# Altium schematic sheet BMS029B_FETs.SchDoc: FETs
size 431 x 279 mm; Date: Not shown in title block; ApprovedBy: Not shown in title block; CheckedBy: Not shown in title block; Author: Not shown in title block; CompanyName: Not shown in title block; DrawnBy: M Sunna; Engineer: Not shown in title block; Organization: Not shown in title block; Address1: Not shown in title block; Address2: Not shown in title block; Address3: Not shown in title block; Address4: Not shown in title block; DocumentNumber: 3; Revision: Use project parameter SCH_Rev; SheetNumber: 3; SheetTotal: 5; PageSetup: Record=PageOptions|CenterHorizontal=True|CenterVertical=True|PrintScale=1.00|XCorrection=1.00|YCorrection=1.00|PrintKind=0|BorderSize=5000000|LeftOffset=0|BottomOffset=0|Orientation=2|PaperLength=1000|PaperWidth=1000|Scale=100|PaperSource=15|PrintQuality=600|MediaType=1|DitherType=10|PaperKind=Letter|PrintScaleMode=1; CurrentTime: Not shown in title block; CurrentDate: Not shown in title block; Time: Not shown in title block; DocumentFullPathAndName: Not shown in title block; DocumentName: Not shown in title block; ModifiedDate: Not shown in title block; ImagePath: Not shown in title block
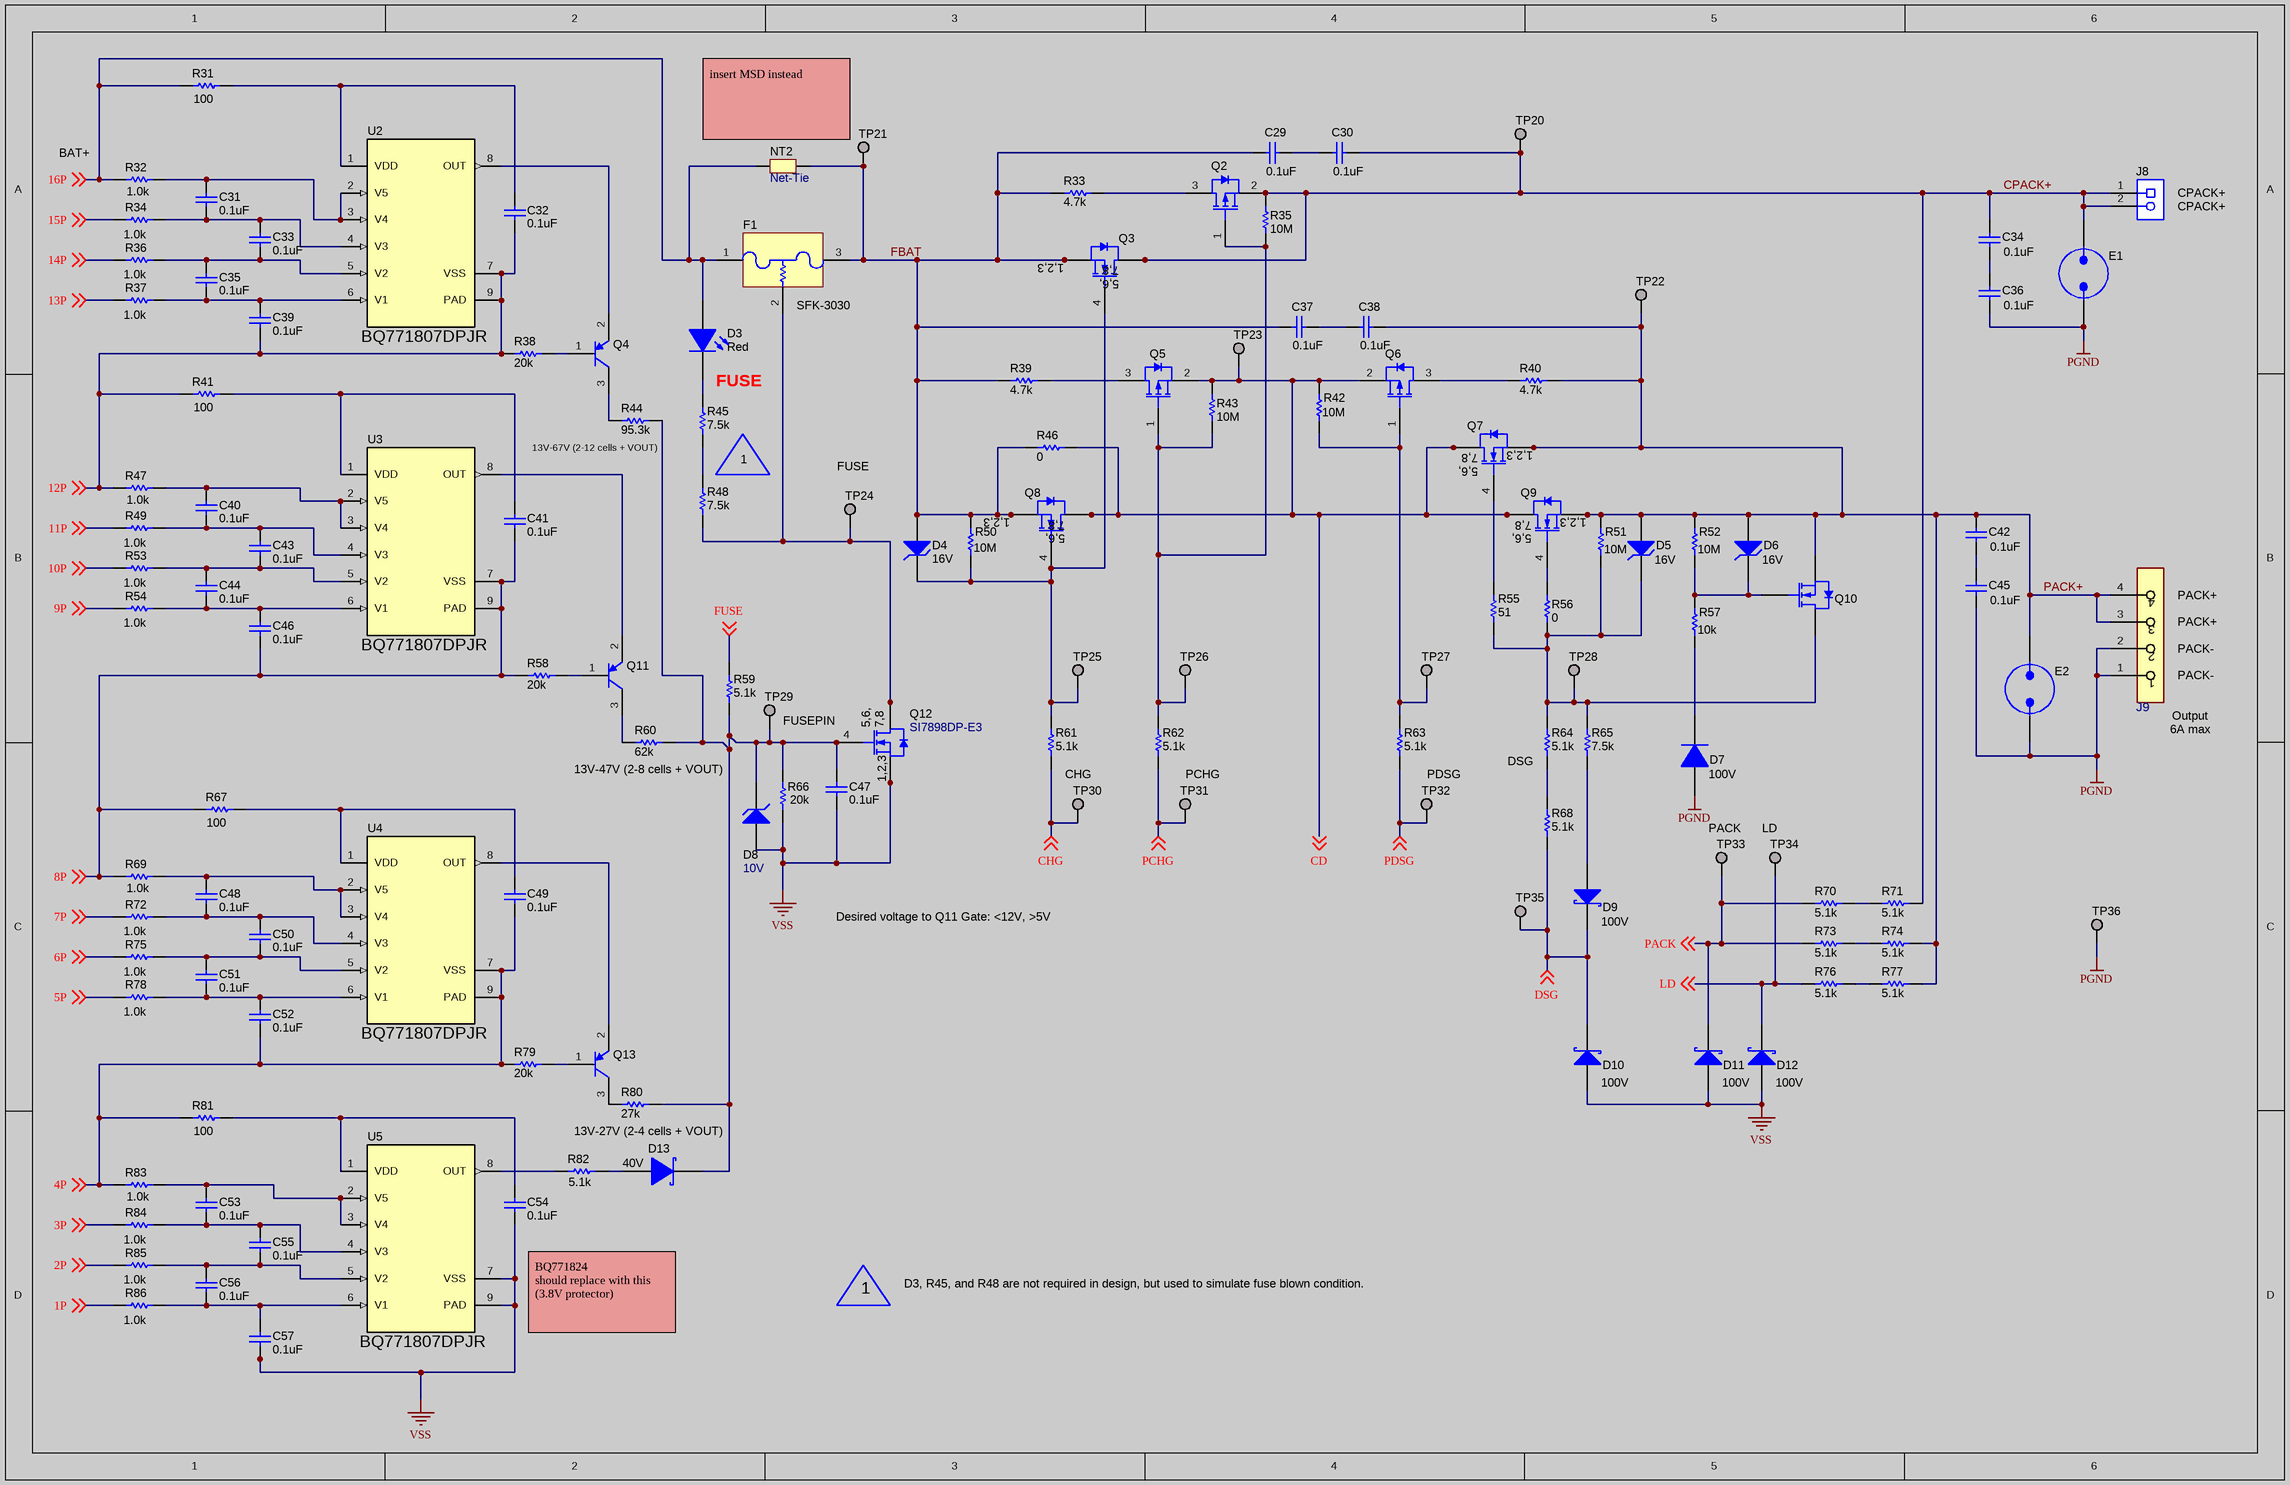
[diagram p0: BMS029B_FETs.SchDoc]

## Parts
C29  ValueDisplayed: 0.1uF  [0603]  (hidden comment: GCJ188R72A104KA01D)
C30  ValueDisplayed: 0.1uF  [0603]  (hidden comment: GCJ188R72A104KA01D)
C31  ValueDisplayed: 0.1uF  [0603]  (hidden comment: 885012206095)
C32  ValueDisplayed: 0.1uF  [0603]  (hidden comment: 885012206095)
C33  ValueDisplayed: 0.1uF  [0603]  (hidden comment: 885012206095)
C34  ValueDisplayed: 0.1uF  [0603]  (hidden comment: GCJ188R72A104KA01D)
C35  ValueDisplayed: 0.1uF  [0603]  (hidden comment: 885012206095)
C36  ValueDisplayed: 0.1uF  [0603]  (hidden comment: GCJ188R72A104KA01D)
C37  ValueDisplayed: 0.1uF  [0603]  (hidden comment: GCJ188R72A104KA01D)
C38  ValueDisplayed: 0.1uF  [0603]  (hidden comment: GCJ188R72A104KA01D)
C39  ValueDisplayed: 0.1uF  [0603]  (hidden comment: 885012206095)
C40  ValueDisplayed: 0.1uF  [0603]  (hidden comment: 885012206095)
C41  ValueDisplayed: 0.1uF  [0603]  (hidden comment: 885012206095)
C42  ValueDisplayed: 0.1uF  [0603]  (hidden comment: GCJ188R72A104KA01D)
C43  ValueDisplayed: 0.1uF  [0603]  (hidden comment: 885012206095)
C44  ValueDisplayed: 0.1uF  [0603]  (hidden comment: 885012206095)
C45  ValueDisplayed: 0.1uF  [0603]  (hidden comment: GCJ188R72A104KA01D)
C46  ValueDisplayed: 0.1uF  [0603]  (hidden comment: 885012206095)
C47  ValueDisplayed: 0.1uF  [0603]  (hidden comment: 885012206095)
C48  ValueDisplayed: 0.1uF  [0603]  (hidden comment: 885012206095)
C49  ValueDisplayed: 0.1uF  [0603]  (hidden comment: 885012206095)
C50  ValueDisplayed: 0.1uF  [0603]  (hidden comment: 885012206095)
C51  ValueDisplayed: 0.1uF  [0603]  (hidden comment: 885012206095)
C52  ValueDisplayed: 0.1uF  [0603]  (hidden comment: 885012206095)
C53  ValueDisplayed: 0.1uF  [0603]  (hidden comment: 885012206095)
C54  ValueDisplayed: 0.1uF  [0603]  (hidden comment: 885012206095)
C55  ValueDisplayed: 0.1uF  [0603]  (hidden comment: 885012206095)
C56  ValueDisplayed: 0.1uF  [0603]  (hidden comment: 885012206095)
C57  ValueDisplayed: 0.1uF  [0603]  (hidden comment: 885012206095)
D3  value Red  [WL-SMCW_RED]  (hidden comment: 150060RS75000)
D4  value 16V  [SOD-123]  (hidden comment: MMSZ5246B-7-F)
D5  value 16V  [SOD-123]  (hidden comment: MMSZ5246B-7-F)
D6  value 16V  [SOD-123]  (hidden comment: MMSZ5246B-7-F)
D7  value 100V  [SOD-123]  (hidden comment: 1N4148W-7-F)
D8  value 10V  [SOD-123]  (hidden comment: MMSZ4697T1G)
D9  value 100V  [SOD-123]  (hidden comment: BAT46W-7-F)
D10  value 100V  [SOD-123]  (hidden comment: BAT46W-7-F)
D11  value 100V  [SOD-123]  (hidden comment: BAT46W-7-F)
D12  value 100V  [SOD-123]  (hidden comment: BAT46W-7-F)
D13  value 40V  [SOT-323]  (hidden comment: BAS40W-7-F)
E1  Spark Gap  [SPARK_GAP2]  (value not drawn)  (no BOM)
E2  Spark Gap  [SPARK_GAP2]  (value not drawn)  (no BOM)
F1  SFK-3030  [FUSE_SFK-xx30x]
J8  ED555/2DS  [TERM_BLK_ED555-2DS]  (value not drawn)
J9  OSTTE040161  [FP-OSTTE040161_HDR4-MFG]  (value not drawn)
NT2  Net-Tie  [Net-Tie_50milWide_30milLong]  (net tie, no BOM)
Q2  SI2325DS-T1-E3  [SOT-23]  (value not drawn)
Q3  BSZ900N15NS3 G  [PG-TSDSON-8]  (value not drawn)
Q4  MMBT5401LT1G  [SOT-23]  (value not drawn)
Q5  SI2325DS-T1-E3  [SOT-23]  (value not drawn)
Q6  SI2325DS-T1-E3  [SOT-23]  (value not drawn)
Q7  BSC160N15NS5ATMA1  [PG-TDSON-8]  (value not drawn)
Q8  BSC160N15NS5ATMA1  [PG-TDSON-8]  (value not drawn)
Q9  BSC160N15NS5ATMA1  [PG-TDSON-8]  (value not drawn)
Q10  MOSFET_N_D3G1S2  [SOT-323]  (value not drawn)
Q11  MMBT5401LT1G  [SOT-23]  (value not drawn)
Q12  SI7898DP-E3  [PowerPAK_SO-8]
Q13  MMBT5401LT1G  [SOT-23]  (value not drawn)
R31  ValueDisplayed: 100  [0603]  (hidden comment: Resistor)
R32  ValueDisplayed: 1.0k  [0603]  (hidden comment: Resistor)
R33  ValueDisplayed: 4.7k  [2512]  (hidden comment: CRCW25124K70JNEG)
R34  ValueDisplayed: 1.0k  [0603]  (hidden comment: Resistor)
R35  ValueDisplayed: 10M  [0603]  (hidden comment: Resistor)
R36  ValueDisplayed: 1.0k  [0603]  (hidden comment: Resistor)
R37  ValueDisplayed: 1.0k  [0603]  (hidden comment: Resistor)
R38  ValueDisplayed: 20k  [0603]  (hidden comment: CRCW060320K0JNEA)
R39  ValueDisplayed: 4.7k  [2512]  (hidden comment: CRCW25124K70JNEG)
R40  ValueDisplayed: 4.7k  [2512]  (hidden comment: CRCW25124K70JNEG)
R41  ValueDisplayed: 100  [0603]  (hidden comment: Resistor)
R42  ValueDisplayed: 10M  [0603]  (hidden comment: Resistor)
R43  ValueDisplayed: 10M  [0603]  (hidden comment: Resistor)
R44  ValueDisplayed: 95.3k  [0603]  (hidden comment: RC0603FR-0795K3L)
R45  ValueDisplayed: 7.5k  [1206]  (hidden comment: CRCW12067K50JNEA)
R46  ValueDisplayed: 0  [2512_WIDE_VISHAY]  (hidden comment: Resistor)
R47  ValueDisplayed: 1.0k  [0603]  (hidden comment: Resistor)
R48  ValueDisplayed: 7.5k  [1206]  (hidden comment: CRCW12067K50JNEA)
R49  ValueDisplayed: 1.0k  [0603]  (hidden comment: Resistor)
R50  ValueDisplayed: 10M  [0603]  (hidden comment: Resistor)
R51  ValueDisplayed: 10M  [0603]  (hidden comment: Resistor)
R52  ValueDisplayed: 10M  [0603]  (hidden comment: Resistor)
R53  ValueDisplayed: 1.0k  [0603]  (hidden comment: Resistor)
R54  ValueDisplayed: 1.0k  [0603]  (hidden comment: Resistor)
R55  ValueDisplayed: 51  [0603]  (hidden comment: CRCW060351R0JNEA)
R56  ValueDisplayed: 0  [0603]  (hidden comment: CRCW06030000Z0EA)
R57  ValueDisplayed: 10k  [0603]  (hidden comment: Resistor)
R58  ValueDisplayed: 20k  [0603]  (hidden comment: CRCW060320K0JNEA)
R59  ValueDisplayed: 5.1k  [0603]  (hidden comment: Resistor)
R60  ValueDisplayed: 62k  [0603]  (hidden comment: RC0603JR-0762KL)
R61  ValueDisplayed: 5.1k  [0603]  (hidden comment: CRCW06035K10JNEA)
R62  ValueDisplayed: 5.1k  [0603]  (hidden comment: CRCW06035K10JNEA)
R63  ValueDisplayed: 5.1k  [0603]  (hidden comment: CRCW06035K10JNEA)
R64  ValueDisplayed: 5.1k  [1206]  (hidden comment: CRCW12065K10JNEA)
R65  ValueDisplayed: 7.5k  [0603]  (hidden comment: CRCW06037K50JNEA)
R66  ValueDisplayed: 20k  [0603]  (hidden comment: Resistor)
R67  ValueDisplayed: 100  [0603]  (hidden comment: Resistor)
R68  ValueDisplayed: 5.1k  [1206]  (hidden comment: CRCW12065K10JNEA)
R69  ValueDisplayed: 1.0k  [0603]  (hidden comment: Resistor)
R70  ValueDisplayed: 5.1k  [1206]  (hidden comment: CRCW12065K10JNEA)
R71  ValueDisplayed: 5.1k  [1206]  (hidden comment: CRCW12065K10JNEA)
R72  ValueDisplayed: 1.0k  [0603]  (hidden comment: Resistor)
R73  ValueDisplayed: 5.1k  [1206]  (hidden comment: CRCW12065K10JNEA)
R74  ValueDisplayed: 5.1k  [1206]  (hidden comment: CRCW12065K10JNEA)
R75  ValueDisplayed: 1.0k  [0603]  (hidden comment: Resistor)
R76  ValueDisplayed: 5.1k  [1206]  (hidden comment: CRCW12065K10JNEA)
R77  ValueDisplayed: 5.1k  [1206]  (hidden comment: CRCW12065K10JNEA)
R78  ValueDisplayed: 1.0k  [0603]  (hidden comment: Resistor)
R79  ValueDisplayed: 20k  [0603]  (hidden comment: CRCW060320K0JNEA)
R80  ValueDisplayed: 27k  [0603]  (hidden comment: CRCW060327K0JNEA)
R81  ValueDisplayed: 100  [0603]  (hidden comment: Resistor)
R82  ValueDisplayed: 5.1k  [0603]  (hidden comment: Resistor)
R83  ValueDisplayed: 1.0k  [0603]  (hidden comment: Resistor)
R84  ValueDisplayed: 1.0k  [0603]  (hidden comment: Resistor)
R85  ValueDisplayed: 1.0k  [0603]  (hidden comment: Resistor)
R86  ValueDisplayed: 1.0k  [0603]  (hidden comment: Resistor)
TP20  TESTPOINT  [TP_VIA_060RND040]  (value not drawn)  (no BOM)
TP21  TESTPOINT  [TP_VIA_060RND040]  (value not drawn)  (no BOM)
TP22  TESTPOINT  [TP_VIA_060RND040]  (value not drawn)  (no BOM)
TP23  TESTPOINT  [TP_VIA_060RND040]  (value not drawn)  (no BOM)
TP24  TESTPOINT  [TP_VIA_060RND040]  (value not drawn)  (no BOM)
TP25  TESTPOINT  [TP_VIA_060RND040]  (value not drawn)  (no BOM)
TP26  TESTPOINT  [TP_VIA_060RND040]  (value not drawn)  (no BOM)
TP27  TESTPOINT  [TP_VIA_060RND040]  (value not drawn)  (no BOM)
TP28  TESTPOINT  [TP_VIA_060RND040]  (value not drawn)  (no BOM)
TP29  TESTPOINT  [TP_VIA_060RND040]  (value not drawn)  (no BOM)
TP30  TESTPOINT  [TP_VIA_060RND040]  (value not drawn)  (no BOM)
TP31  TESTPOINT  [TP_VIA_060RND040]  (value not drawn)  (no BOM)
TP32  TESTPOINT  [TP_VIA_060RND040]  (value not drawn)  (no BOM)
TP33  TESTPOINT  [TP_VIA_060RND040]  (value not drawn)  (no BOM)
TP34  TESTPOINT  [TP_VIA_060RND040]  (value not drawn)  (no BOM)
TP35  TESTPOINT  [TP_VIA_060RND040]  (value not drawn)  (no BOM)
TP36  TESTPOINT  [TP_VIA_060RND040]  (value not drawn)  (no BOM)
U2  BQ771807DPJR  [DPJ0008A]
U3  BQ771807DPJR  [DPJ0008A]
U4  BQ771807DPJR  [DPJ0008A]
U5  BQ771807DPJR  [DPJ0008A]

## Nets
PGND: C36.2 C45.2 D7.2(A) E1.2 E2.2 J9.1 J9.2 TP36.1
VSS: C47.1 C54.1 C57.1 D8.2(A) D10.2(A) D11.2(A) D12.2(A) Q12.1(S) Q12.2(S) Q12.3(S) R66.1 U5.7(VSS) U5.9(PAD)
1P: R86.1 ; off-sheet 1P
2P: R85.1 ; off-sheet 2P
3P: R84.1 ; off-sheet 3P
4P: C49.1 C52.1 R79.1 R81.1 R83.1 U4.7(VSS) U4.9(PAD) ; off-sheet 4P
5P: R78.1 ; off-sheet 5P
6P: R75.1 ; off-sheet 6P
7P: R72.1 ; off-sheet 7P
8P: C41.1 C46.1 R58.1 R67.1 R69.1 U3.7(VSS) U3.9(PAD) ; off-sheet 8P
9P: R54.1 ; off-sheet 9P
10P: R53.1 ; off-sheet 10P
11P: R49.1 ; off-sheet 11P
12P: C32.1 C39.1 R38.1 R41.1 R47.1 U2.7(VSS) U2.9(PAD) ; off-sheet 12P
13P: R37.1 ; off-sheet 13P
14P: R36.1 ; off-sheet 14P
15P: R34.1 ; off-sheet 15P
16P: D3.2(A) F1.1(Fuse) NT2.2 R31.1 R32.1 ; off-sheet 16P
CD: Q5.2(S) Q6.2(S) Q7.5(D) Q7.6(D) Q7.7(D) Q7.8(D) Q7.9(D) Q8.5(D) Q8.6(D) Q8.7(D) Q8.8(D) Q8.9(D) Q9.5(D) Q9.6(D) Q9.7(D) Q9.8(D) Q9.9(D) R42.1 R43.1 R46.2 TP23.1 ; off-sheet CD
CHG: R61.1 TP30.1 ; off-sheet CHG
CPACK+: C30.1 C34.1 E1.1 J8.1 J8.2 Q2.2(S) Q3.5(D) Q3.6(D) Q3.7(D) Q3.8(D) Q3.9(D) R35.1 R71.1 TP20.1
DSG: D9.1(K) D10.1(K) R68.1 TP35.1 ; off-sheet DSG
FBAT: C29.2 C37.2 D4.2(A) F1.3(Fuse) NT2.1 Q3.1(S) Q3.2(S) Q3.3(S) Q8.1(S) Q8.2(S) Q8.3(S) R33.1 R39.1 R46.1 R50.1 TP21.1
FUSE: R59.2 ; off-sheet FUSE
LD: D12.1(K) R76.2 TP34.1 ; off-sheet LD
PACK: D11.1(K) R70.2 R73.2 TP33.1 ; off-sheet PACK
PACK+: C38.1 C42.1 D5.2(A) D6.2(A) E2.1 J9.3 J9.4 Q7.1(S) Q7.2(S) Q7.3(S) Q9.1(S) Q9.2(S) Q9.3(S) Q10.2(S) R40.2 R51.1 R52.1 R74.1 R77.1 TP22.1
PCHG: R62.1 TP31.1 ; off-sheet PCHG
PDSG: R63.1 TP32.1 ; off-sheet PDSG
NetC29_1: C29.1 C30.2
NetC31_1: C31.1 C33.2 R34.2 U2.4(V3)
NetC31_2: C31.2 R32.2 U2.2(V5) U2.3(V4)
NetC32_2: C32.2 R31.2 U2.1(VDD)
NetC33_1: C33.1 C35.2 R36.2 U2.5(V2)
NetC34_2: C34.2 C36.1
NetC35_1: C35.1 C39.2 R37.2 U2.6(V1)
NetC37_1: C37.1 C38.2
NetC40_1: C40.1 C43.2 R49.2 U3.4(V3)
NetC40_2: C40.2 R47.2 U3.2(V5) U3.3(V4)
NetC41_2: C41.2 R41.2 U3.1(VDD)
NetC42_2: C42.2 C45.1
NetC43_1: C43.1 C44.2 R53.2 U3.5(V2)
NetC44_1: C44.1 C46.2 R54.2 U3.6(V1)
NetC47_2: C47.2 D8.1(K) D13.3(K) Q12.4(G) R44.2 R59.1 R60.2 R66.2 R80.2 TP29.1
NetC48_1: C48.1 C50.2 R72.2 U4.4(V3)
NetC48_2: C48.2 R69.2 U4.2(V5) U4.3(V4)
NetC49_2: C49.2 R67.2 U4.1(VDD)
NetC50_1: C50.1 C51.2 R75.2 U4.5(V2)
NetC51_1: C51.1 C52.2 R78.2 U4.6(V1)
NetC53_1: C53.1 C55.2 R84.2 U5.4(V3)
NetC53_2: C53.2 R83.2 U5.2(V5) U5.3(V4)
NetC54_2: C54.2 R81.2 U5.1(VDD)
NetC55_1: C55.1 C56.2 R85.2 U5.5(V2)
NetC56_1: C56.1 C57.2 R86.2 U5.6(V1)
NetD3_1: D3.1(K) R45.2
NetD4_1: D4.1(K) Q3.4(G) Q8.4(G) R50.2 R61.2 TP25.1
NetD5_1: D5.1(K) Q10.3(D) R51.2 R55.2 R56.2 R64.2 R65.2 TP28.1
NetD6_1: D6.1(K) Q10.1(G) R52.2 R57.1
NetD7_1: D7.1(K) R57.2
NetD9_2: D9.2(A) R65.1
NetD13_1: D13.1(A) R82.2
NetF1_2: F1.2(Heater) Q12.5(D) Q12.6(D) Q12.7(D) Q12.8(D) Q12.9(D) R48.1 TP24.1
NetQ2_1: Q2.1(G) Q5.1(G) R35.2 R43.2 R62.2 TP26.1
NetQ2_3: Q2.3(D) R33.2
NetQ4_1: Q4.1(B) R38.2
NetQ4_2: Q4.2(E) U2.8(OUT)
NetQ4_3: Q4.3(C) R44.1
NetQ5_3: Q5.3(D) R39.2
NetQ6_1: Q6.1(G) R42.2 R63.2 TP27.1
NetQ6_3: Q6.3(D) R40.1
NetQ7_4: Q7.4(G) R55.1
NetQ9_4: Q9.4(G) R56.1
NetQ11_1: Q11.1(B) R58.2
NetQ11_2: Q11.2(E) U3.8(OUT)
NetQ11_3: Q11.3(C) R60.1
NetQ13_1: Q13.1(B) R79.2
NetQ13_2: Q13.2(E) U4.8(OUT)
NetQ13_3: Q13.3(C) R80.1
NetR45_1: R45.1 R48.2
NetR64_1: R64.1 R68.2
NetR70_1: R70.1 R71.2
NetR73_1: R73.1 R74.2
NetR76_1: R76.1 R77.2
NetR82_1: R82.1 U5.8(OUT)

## Notes on the sheet
- BAT+
- insert MSD instead
- (near J8) CPACK+
- FUSE
- (near R44) 13V-67V (2-12 cells + VOUT)
- 1
- (near TP24) FUSE
- (near J9) PACK+
- (near J9) PACK-
- (near R60) 13V-47V (2-8 cells + VOUT)
- (near TP29) FUSEPIN
- (near R64) DSG
- (near J9) Output
- 6A max
- CHG
- PCHG
- PDSG
- (near TP33) PACK
- (near TP34) LD
- Desired voltage to Q11 Gate: <12V, >5V
- 13V-27V (2-4 cells + VOUT)
- D3, R45, and R48 are not required in design, but used to simulate fuse blown condition.
- BQ771824
  should replace with this (3.8V protector)
- (in symbol CMP-0001051-2) 1,2,3; 7,8; 5,6,
- (in symbol CMP-0001069-3) 5,6,; 7,8; 1,2,3
- (in symbol CMP-0067566-1) 7,8; 1,2,3; 5,6,

## Library data of the parts
C29 C30 C34 C36-C38 C42 C45 = CMP-0064935-4: CAP, CERM, 0.1 uF, 100 V,+/- 10%, X7R, AEC-Q200 Grade 1, 0603; Manufacturer: MuRata; TaMin_C: -55°C; Polarized: N; SizeAreaWB_mm2: 4.68; Value1: Unknown; U/M: EA; Value: 0.1uF; TaMax_C: 125°C; SizeZ_mm: 1; SizeX_mm: 1.6; SizeY_mm: 0.8; Value2: 100V; SizeArea_mm2: 1.28; AEC Qualified: Y; Cap_F: 100nF; AEC Category: Q200; Supplier Part Number 2: 81-GCJ188R72A104KA1D; Publisher: Texas Instruments; Supplier 2: Mouser; TempCo: X7R; Published: 2008-06-19; RoHS: Y; MountType: SMT; Supplier 1: Digi-Key; PackageReference: 0603; Tolerance_%: 10%; Cap_Case: 0603; CompType: Capacitor; LatestRevisionDate: 2017-06-05; PartNumber: GCJ188R72A104KA01D; VDC_V: 100V; ComponentLink1Description: Datasheet link; AEC Grade: 1; Supplier Part Number 1: 490-13420-1-ND; Technology: Ceramic; ComponentLink1URL: http://search.murata.co.jp/Ceramy/image/img/A01X/G101/ENG/GCJ188R72A104KA01-01.pdf
C31-C33 C35 C39-C41 C43 C44 C46-C57 = CMP-0006837-4: CAP, CERM, 0.1 uF, 50 V, +/- 10%, X7R, 0603; Manufacturer: Wurth Elektronik; Polarized: N; Value: 0.1uF; U/M: EA; Cap_F: 100nF; Value1: Unknown; VDC_V: 50V; TaMin_C: -55°C; TaMax_C: 125°C; SizeArea_mm2: 1.28; SizeAreaWB_mm2: 4.68; SizeX_mm: 1.6; SizeY_mm: 0.8; SizeZ_mm: 1; AEC Category: Q200; CompType: Capacitor; PartNumber: 885012206095; PackageReference: 0603; RoHS: Y; Tolerance_%: 10%; Value2: 50V; MountType: SMT; Technology: Ceramic; TempCo: X7R; Cap_Case: 0603; Published: 2008-06-19; Publisher: Texas Instruments; LatestRevisionDate: 2017-03-09; ComponentLink1Description: Datasheet link; ComponentLink1URL: http://katalog.we-online.de/pbs/datasheet/885012206095.pdf; AEC Qualified: N; AEC Grade: N/A
D3 = CMP-0002947-3: LED, Red, SMD; Manufacturer: Wurth Elektronik; Type: AlInGaP; Vf_V: 2V; Io_A: 30mA; Vr_V: 5V; Tjmax_C: 85°C; Power_TotalModule: 72mW; Value1: 0.072W; Angle: 140; CompType: LED; PartNumber: 150060RS75000; MountType: SMT; RoHS: Y; PackageReference: LED_0603; Value2: 2V; Color: Red; ComponentLink1URL: http://katalog.we-online.de/led/datasheet/150060RS75000.pdf; ComponentLink1Description: Datasheet link
D4 = CMP-0005754-4: Diode, Zener, 16 V, 500 mW, SOD-123; Manufacturer: Diodes Inc.; Power_W: 500mW; SizeAreaWB_mm2: 13.095; Value1: 0.5W; RJA_CperW: 350; SizeZ_mm: 1.35; SizeX_mm: 3.85; SizeY_mm: 1.7; SizeArea_mm2: 6.545; AEC Category: Q101; Vz_V: 16V; RoHS: Y; MountType: SMT; PackageReference: SOD-123; CompType: Zener; PartNumber: MMSZ5246B-7-F; AEC Qualified: ?; ComponentLink1Description: Datasheet link; ComponentLink1URL: http://www.diodes.com/datasheets/ds18010.pdf
D5 D6 = CMP-0005754-4: Diode, Zener, 16 V, 500 mW, SOD-123; Manufacturer: Diodes Inc.; Power_W: 500mW; SizeY_mm: 1.7; Value1: 0.5W; SizeX_mm: 3.85; RJA_CperW: 350; SizeAreaWB_mm2: 13.095; SizeArea_mm2: 6.545; AEC Category: Q101; SizeZ_mm: 1.35; MountType: SMT; Vz_V: 16V; PackageReference: SOD-123; PartNumber: MMSZ5246B-7-F; AEC Qualified: ?; CompType: Zener; ComponentLink1Description: Datasheet link; RoHS: Y; ComponentLink1URL: http://www.diodes.com/datasheets/ds18010.pdf
D7 = CMP-0029001-2: Diode, Ultrafast, 100 V, 0.15 A, SOD-123; Manufacturer: Diodes Inc.; Vf_V: 1.25V; Value1: 0.15A; Io_A: 1.5dA; TJmax_C: 150°C; SizeAreaWB_mm2: 13.095; SizeArea_mm2: 6.545; SizeX_mm: 3.85; SizeY_mm: 1.7; SizeZ_mm: 1.35; AEC Category: Q101; Green_Lifecycle: Active; Green_REACh: Passed; PartNumber: 1N4148W-7-F; PackageReference: SOD-123; CompType: Diode; Value2: 1.25V; Vr_V: 100V; MountType: SMT; Type: Ultrafast; RoHS: Y; ComponentLink1Description: Datasheet link; ComponentLink1URL: http://www.diodes.com/datasheets/ds30086.pdf; AEC Qualified: ?; Green_EU RoHS: Passed; Green_EU RoHS-2: Passed
D8 = CMP-0005740-3: Diode, Zener, 10 V, 500 mW, SOD-123; Manufacturer: ON Semiconductor; SizeY_mm: 1.7; SizeX_mm: 3.85; RJA_CperW: 340; SizeAreaWB_mm2: 13.095; AEC Category: Q101; Power_W: 500mW; SizeZ_mm: 1.35; Value1: 0.5W; SizeArea_mm2: 6.545; PackageReference: SOD-123; AEC Qualified: ?; MountType: SMT; RoHS: Y; ComponentLink1Description: Datasheet link; PartNumber: MMSZ4697T1G; CompType: Zener; ComponentLink1URL: http://www.onsemi.com/pub_link/Collateral/MMSZ4678T1-D.PDF; Vz_V: 10V
D9-D12 = CMP-0028450-2: Diode, Schottky, 100 V, 0.15 A, SOD-123; Manufacturer: Diodes Inc.; Io_A: 150mA; SizeArea_mm2: 6.545; SizeX_mm: 3.85; Value2: 0.6V; Value1: 0.15A; AEC Category: Q101; SizeZ_mm: 1.35; SizeY_mm: 1.7; Green_Lifecycle: Active; Green_REACh: Passed; SizeAreaWB_mm2: 13.095; Vf_V: 600mV; ComponentLink1Description: Datasheet link; MountType: SMT; ComponentLink1URL: http://www.diodes.com/datasheets/ds30044.pdf; Vr_V: 100V; PartNumber: BAT46W-7-F; Type: Schottky; AEC Qualified: ?; Green_EU RoHS-2: Passed; Green_EU RoHS: Passed; CompType: Diode; RoHS: Y; PackageReference: SOD-123
D13 = CMP-0028438-2: Diode, Schottky, 40 V, 0.2 A, SOT-323; Manufacturer: Diodes Inc.; Value2: 0.9V; SizeArea_mm2: 4.84; Vf_V: 9dV; Value1: 0.2A; Green_Lifecycle: Not Set; SizeAreaWB_mm2: 10.24; SizeX_mm: 2.2; AEC Category: Q101; Io_A: 2dA; Green_REACh: Incomplete; SizeZ_mm: 1.1; Green_EU RoHS-2: Incomplete; PartNumber: BAS40W-7-F; RoHS: Y; CompType: Diode; ComponentLink1Description: Datasheet link; Green_EU RoHS: Incomplete; Vr_V: 40V; MountType: SMT; SizeY_mm: 2.2; Type: Schottky; ComponentLink1URL: http://www.diodes.com/datasheets/ds30114.pdf; PackageReference: SOT-323; AEC Qualified: ?
E1 E2 = CMP-0079939-1: CompType: Spark Gap
F1 = CMP-0078325-2: Fuse, 30 A, 62 VDC, SMD; Manufacturer: Dexerials Corporation; Irating_A: 30A; VDC_V: 62V; Rtyp_Ohm: 1.75m; PartNumber: SFK-3030; PackageReference: 9.5x2x5mm; CompType: Fuse; ComponentLink1Description: Datasheet URL; MountType: SMT; ComponentLink1URL: https://sps16.itg.ti.com/sites/KMS/crossdivteams/altium/docs/ComponentDatasheets/Dexerials_SFK-xx30x.pdf; RoHS: Y
J8 = CMP-0074913-1: Terminal Block, 3.5mm Pitch, 2x1, TH; Manufacturer: On-Shore Technology; Cert_VDE: Y; CNHeader: False; Current_A: 6A; Green_Lifecycle: Active; Shrouded: N; Gender: Female; Green_REACh: Passed; Voltage_V: 150V; Row_Count: 1; Pitch_mm: 3.5; ContactFinish: Brass; CT: True; ComponentLink1URL: http://on-shore.com/sites/default/files/manuals/ed555ds.pdf; Publisher: Texas Instruments; Color: Grey; Cert_CULUS: Y; RoHS: Y; MountType: TH; Green_EU RoHS-2: Passed; Supplier 1: Digi-Key; Green_EU RoHS: Passed with Exemption; PackageReference: 7.0x8.2x6.5mm; PinCount: 2; CompType: Terminal Block; LatestRevisionDate: 2017-07-12; PartNumber: ED555/2DS; ComponentLink1Description: Datasheet URL; Supplier Part Number 1: ED1514-ND
J9 = CMP-0087048-1: TERM BLOCK 3.5MM VERT 4POS PCB; Manufacturer: On Shore Technology; Row_Count: 1; Current_A: 10A; ContactFinish: Tin; Voltage_V: 300V; PinCount: 4; Symbol Name: SYM-OSTTE040161; PartNumber: OSTTE040161; PackageReference: HDR4; ComponentLink1URL: http://www.on-shore.com/wp-content/uploads/2019/02/OSTTEXX0161.pdf; ComponentLink1Description: Datasheet; RoHS: TRUE
NT2 = CMP-0078142-3: Single point connection between nets.; MountType: SMT; PackageReference: N/A; CompType: Net-Tie; Library Reference: Net-Tie; Manufacturer: N/A; PartNumber: N/A
Q2 Q5 Q6 = CMP-0000093-3: MOSFET, P-CH, -150 V, -0.53 A, SOT-23; Manufacturer: Vishay-Siliconix; Alternate Manufacturer: None; SizeZ_mm: 1.1; SizeAreaWB_mm2: 14; Value: -150V; SizeY_mm: 3; AEC Category: Q101; IdsMax_A: -530mA; Value2: 7.7 nC; ChMode: Enhancement; QgTyp_nC: 7.7; Vgs_V: -20V; ChType: P; SizeX_mm: 2.5; SizeArea_mm2: 7.5; AEC Qualified: N; PackageReference: SOT-23; ComponentLink1URL: http://www.vishay.com/doc?73238; MountType: SMT; CompType: MOSFET; VdsMax_V: -150V; ComponentLink1Description: Datasheet link; RoHS: Y; PartNumber: SI2325DS-T1-E3
Q3 = CMP-0001051-2: MOSFET, N-CH, 150 V, 13 A, PG-TSDSON-8; Alternate Manufacturer: None; Manufacturer: Infineon Technologies; SizeZ_mm: 1.1; ChType: N; Value2: 5 nC; VdsMax_V: 150V; SizeX_mm: 3.4; Vgs_V: 20V; QgTyp_nC: 5; Value: 150V; SizeArea_mm2: 11.56; AEC Category: Q101; IdsMax_A: 13A; SizeAreaWB_mm2: 19.36; U/M: EA; Supplier 2: Mouser; Supplier 1: Digi-Key; Supplier Part Number 1: BSZ900N15NS3 GCT-ND; Supplier Part Number 2: 726-BSZ900N15NS3G; PartNumber: BSZ900N15NS3 G; ComponentLink1Description: Datasheet link; LatestRevisionDate: 2017-03-09; SizeY_mm: 3.4; CompType: MOSFET; LatestRevisionNote: Added parts.; Publisher: Texas Instruments; AEC Qualified: ?; Published: 2008-06-19; RoHS: Y; PackageReference: PG-TSDSON-8; MountType: SMT; ComponentLink1URL: http://www.infineon.com/dgdl/BSZ900N15NS3+Rev2.1_.pdf?folderId=db3a304326623792012669f6bee2224b&fileId=db3a304326623792012669f7decc224c
Q4 Q11 Q13 = CMP-0000333-2: Transistor, PNP, 150 V, 0.5 A, SOT-23; Manufacturer: ON Semiconductor; TaMax_C: 150°C; Value2: 240; Value1: 0.5 A; Vcesat1_V: 500mV; SizeX_mm: 2.5; SizeY_mm: 3; TaMin_C: -55°C; IcRated_A: 500mA; CompType: BJT; SizeZ_mm: 1.1; Value: 150 V; SizeArea_mm2: 7.5; NPN: 0; Vceo_V: 150V; PNP: 1; AEC Category: Q101; SizeAreaWB_mm2: 14; U/M: EA; Supplier 2: Newark; Supplier 3: Mouser; Supplier 1: Digi-Key; Supplier Part Number 1: MMBT5401LT1GOSCT-ND; Supplier Part Number 2: 88H4794; Supplier Part Number 3: 863-MMBT5401LT1G; PartNumber: MMBT5401LT1G; LatestRevisionDate: 2017-03-09; Publisher: Texas Instruments; AEC Qualified: ?; ComponentLink1Description: Datasheet link; HfeMax: 240; Published: 2008-07-31; RoHS: Y; PackageReference: SOT-23; MountType: SMT; ComponentLink1URL: http://www.onsemi.com/pub_link/Collateral/MMBT5401LT1-D.PDF
Q7-Q9 = CMP-0067566-1: MOSFET, N-CH, 150 V, 56 A, PG-TDSON-8; Alternate Manufacturer: None; Manufacturer: Infineon Technologies; QgTyp_nC: 19.0; SizeAreaWB_mm2: 55.131; Vgs_V: 20V; Value1: ? ohm; VdsMax_V: 150V; U/M: EA; Value: 150V; IdsMax_A: 56A; SizeZ_mm: 1.12; SizeX_mm: 5.99; SizeY_mm: 4.9; Value2: 19 nC; SizeArea_mm2: 29.351; ChType: N; AEC Category: Q101; ComponentLink1URL: http://www.infineon.com/dgdl/Infineon-BSC160N15NS5-DS-v02_02-EN.pdf?fileId=5546d46253f650570154a055b7215b1b; Supplier Part Number 2: 726-BSC160N15NS5ATM; Publisher: Texas Instruments; Supplier 2: Mouser; Published: 2008-06-19; RoHS: Y; MountType: SMT; Supplier 1: Digi-Key; LatestRevisionNote: Added parts.; PackageReference: PG-TDSON-8; CompType: MOSFET; LatestRevisionDate: 2017-06-05; PartNumber: BSC160N15NS5ATMA1; AEC Qualified: N; ComponentLink1Description: Datasheet link; Supplier Part Number 1: BSC160N15NS5ATMA1-ND
Q10 = CMP-0000774-1: MOSFET, N-CH, 60 V, 0.31 A, SOT-323; PartNumber: 2N7002KW; Manufacturer: Fairchild Semiconductor; Alternate Manufacturer: None; Value: 60V; U/M: EA; ChType: N; Value1: 1; Rdson45_ohm: 1.6; Vgs_V: 2.1V; IdsMax_A: 3.1dA; SizeAreaWB_mm2: 10.24; SizeArea_mm2: 4.84; SizeX_mm: 2.2; SizeZ_mm: 1.1; AEC Category: Q101; Green_Lifecycle: Active; Green_REACh: Passed; SymbolVersion: 2008-07-28; CompType: MOSFET; PackageReference: SOT-323; VdsMax_V: 60V; RoHS: Y; MountType: SMT; Published: 2008-06-19; Publisher: Texas Instruments; LatestRevisionDate: 2017-03-09; LatestRevisionNote: Added parts.; ComponentLink1Description: Datasheet link; ComponentLink1URL: http://www.fairchildsemi.com/ds/2N/2N7002KW.pdf; Supplier 1: Digi-Key; Supplier Part Number 1: 2N7002KWCT-ND; Supplier 2: Mouser; Supplier Part Number 2: 512-2N7002KW; SizeY_mm: 2.2; AEC Qualified: ?; Green_EU RoHS: Passed; Green_EU RoHS-2: Passed
Q12 = CMP-0001069-3: MOSFET, N-CH, 150 V, 3 A, PowerPAK SO-8; Alternate Manufacturer: None; Manufacturer: Vishay-Siliconix; SizeZ_mm: 1.12; ChType: N; Value2: 17 nC; Value1: 0.07; VdsMax_V: 150V; SizeX_mm: 5.99; SizeAreaWB_mm2: 55.131; SizeY_mm: 4.9; Vgs_V: 20V; QgTyp_nC: 17; Value: 150V; Rdson45_ohm: 0.076; SizeArea_mm2: 29.351; AEC Category: Q101; IdsMax_A: 3A; U/M: EA; Supplier 1: Digi-Key; Supplier Part Number 1: SI7898DP-T1-E3CT-ND; PartNumber: SI7898DP-E3; ComponentLink1Description: Datasheet link; CompType: MOSFET; LatestRevisionNote: Added parts.; Publisher: Texas Instruments; AEC Qualified: ?; Published: 2008-06-19; RoHS: Y; LatestRevisionDate: 2017-03-09; PackageReference: PowerPAK SO-8; MountType: SMT; ComponentLink1URL: http://www.vishay.com/docs/71873/71873.pdf
R31 R41 R67 R81 = CMP-0025700-4: RES, 100, 5%, 0.1 W, AEC-Q200 Grade 0, 0603; PartNumber: CRCW0603100RJNEA; Manufacturer: Vishay-Dale; Value: 100; Value_Code: 100R; Power_W: 100mW; Value2: 0.1W; VDC_V: 75V; TempCo: 200 ppm/C; EIA_Code: E24; U/M: EA; SizeArea_mm2: 1.28; SizeX_mm: 1.6; SizeY_mm: 0.8; SizeZ_mm: 1; AEC Category: Q200; AEC Qualified: Y; AEC Grade: 0; CompType: Resistor; SymbolVersion: 2009-05-29; PackageReference: 0603; RoHS: E; Res_ohm: 100; Tolerance_%: 5%; Value1: 5%; MountType: SMT; Technology: Thick Film; Published: 2008-06-26; Publisher: Texas Instruments; LatestRevisionDate: 2017-06-13; ComponentLink1Description: Datasheet link; ComponentLink1URL: http://www.vishay.com/docs/20035/dcrcwe3.pdf; Supplier 1: Digi-Key; Supplier Part Number 1: 541-100GCT-ND; Supplier 2: Newark; Supplier Part Number 2: 59M6764; Supplier 3: Mouser; Supplier Part Number 3: 71-CRCW0603J-100-E3
R32 R34 R36 R37 R47 R49 R53 R54 R69 R72 R75 R78 R83-R86 = CMP-0025729-4: RES, 1.0 k, 5%, 0.1 W, AEC-Q200 Grade 0, 0603; PartNumber: CRCW06031K00JNEA; Manufacturer: Vishay-Dale; Value: 1.0k; Res_ohm: 1k; Value_Code: 1k00; Power_W: 100mW; Value2: 0.1W; VDC_V: 75V; TempCo: 200 ppm/C; EIA_Code: E24; U/M: EA; SizeArea_mm2: 1.28; SizeX_mm: 1.6; SizeY_mm: 0.8; SizeZ_mm: 1; AEC Category: Q200; AEC Qualified: Y; AEC Grade: 0; CompType: Resistor; SymbolVersion: 2009-05-29; PackageReference: 0603; RoHS: E; Tolerance_%: 5%; Value1: 5%; MountType: SMT; Technology: Thick Film; Published: 2008-06-26; Publisher: Texas Instruments; LatestRevisionDate: 2017-06-13; ComponentLink1Description: Datasheet link; ComponentLink1URL: http://www.vishay.com/docs/20035/dcrcwe3.pdf; Supplier 1: Digi-Key; Supplier Part Number 1: 541-1.0KGCT-ND; Supplier 2: Newark; Supplier Part Number 2: 59M6750; Supplier 3: Mouser; Supplier Part Number 3: 71-CRCW0603J-1.0K-E3
R33 R39 R40 = CMP-0015972-3: RES, 4.7 k, 5%, 1 W, AEC-Q200 Grade 0, 2512; Manufacturer: Vishay-Dale; Power_W: 1W; TempCo: 200 ppm/C; Value_Code: 4k70; Value: 4.7k; EIA_Code: E24; SizeX_mm: 6.3; SizeY_mm: 3.2; SizeZ_mm: 0.71; SizeArea_mm2: 20.16; AEC Qualified: Y; VDC_V: 500V; AEC Grade: 0; AEC Category: Q200; RoHS: E; Value1: 5%; MountType: SMT; Supplier 1: Digi-Key; PackageReference: 2512; Tolerance_%: 5%; Res_ohm: 4.7k; Value2: 1W; CompType: Resistor; PartNumber: CRCW25124K70JNEG; ComponentLink1Description: Datasheet link; Supplier Part Number 1: 541-4.7KXCT-ND; Technology: Thick Film; ComponentLink1URL: http://www.vishay.com/docs/20035/dcrcwe3.pdf
R35 R42 R43 R50-R52 = CMP-0025702-4: RES, 10 M, 5%, 0.1 W, AEC-Q200 Grade 0, 0603; PartNumber: CRCW060310M0JNEA; Manufacturer: Vishay-Dale; Value: 10Meg; Value_Code: 10M0; Power_W: 100mW; Value2: 0.1W; VDC_V: 75V; TempCo: 200 ppm/C; EIA_Code: E24; U/M: EA; SizeArea_mm2: 1.28; SizeX_mm: 1.6; SizeY_mm: 0.8; SizeZ_mm: 1; AEC Category: Q200; AEC Qualified: Y; AEC Grade: 0; CompType: Resistor; SymbolVersion: 2009-05-29; PackageReference: 0603; RoHS: E; Res_ohm: 10M; Tolerance_%: 5%; Value1: 5%; MountType: SMT; Technology: Thick Film; Published: 2008-06-26; Publisher: Texas Instruments; LatestRevisionDate: 2017-06-13; ComponentLink1Description: Datasheet link; ComponentLink1URL: http://www.vishay.com/docs/20035/dcrcwe3.pdf; Supplier 1: Digi-Key; Supplier Part Number 1: 541-10MGCT-ND; Supplier 2: Newark; Supplier Part Number 2: 59M6761; Supplier 3: Mouser; Supplier Part Number 3: 71-CRCW0603J-10M-E3
R38 R58 R79 = CMP-0025753-4: RES, 20 k, 5%, 0.1 W, AEC-Q200 Grade 0, 0603; Manufacturer: Vishay-Dale; Value: 20k; Value_Code: 20k0; Power_W: 100mW; Value2: 0.1W; VDC_V: 75V; TempCo: 200 ppm/C; EIA_Code: E24; SizeArea_mm2: 1.28; SizeX_mm: 1.6; SizeY_mm: 0.8; SizeZ_mm: 1; AEC Category: Q200; AEC Qualified: Y; AEC Grade: 0; CompType: Resistor; PartNumber: CRCW060320K0JNEA; PackageReference: 0603; RoHS: E; Res_ohm: 20k; Tolerance_%: 5%; Value1: 5%; MountType: SMT; Technology: Thick Film; ComponentLink1Description: Datasheet link; ComponentLink1URL: http://www.vishay.com/docs/20035/dcrcwe3.pdf; Supplier 1: Digi-Key; Supplier Part Number 1: 541-20KGCT-ND; Supplier 2: Newark; Supplier Part Number 2: 59M6783; Supplier 3: Mouser; Supplier Part Number 3: 71-CRCW0603J-20K-E3
R44 = CMP-0023326-5: RES, 95.3 k, 1%, 0.1 W, 0603; Manufacturer: Yageo; Power_W: 100mW; TempCo: 100 ppm/C; Value_Code: 95k3; Value: 95.3k; EIA_Code: E96; SizeX_mm: 1.6; SizeY_mm: 0.8; SizeZ_mm: 1; Value2: 0.1W; SizeArea_mm2: 1.28; AEC Qualified: N; VDC_V: 75V; AEC Category: Q200; SizeAreaWB_mm2: 4.68; Supplier Part Number 2: 603-RC0603FR-0795K3L; Supplier 2: Mouser; RoHS: Y; Value1: 1%; MountType: SMT; Supplier 1: Digi-Key; PackageReference: 0603; Tolerance_%: 1%; Res_ohm: 95.3k; CompType: Resistor; PartNumber: RC0603FR-0795K3L; ComponentLink1Description: Datasheet link; Supplier Part Number 1: 311-95.3KHRCT-ND; Technology: Thick Film; ComponentLink1URL: http://www.yageo.com/pdf/Pu-RC0603_51_PbFree_L_2.pdf; AEC Grade: N/A
R45 R48 = CMP-0018728-3: RES, 7.5 k, 5%, 0.25 W, AEC-Q200 Grade 0, 1206; Manufacturer: Vishay-Dale; Power_W: 250mW; TempCo: 200 ppm/C; Value_Code: 7k50; Value: 7.5k; EIA_Code: E24; SizeX_mm: 3.2; SizeY_mm: 1.6; SizeZ_mm: 1.35; Value2: 0.25W; SizeArea_mm2: 5.12; AEC Qualified: Y; VDC_V: 200V; AEC Category: Q200; AEC Grade: 0; Supplier Part Number 2: 89M6889; Supplier 2: Newark; Supplier Part Number 3: 71-CRCW1206J-7.5K-E3; Supplier 3: Mouser; RoHS: E; Value1: 5%; MountType: SMT; Supplier 1: Digi-Key; PackageReference: 1206; Tolerance_%: 5%; Res_ohm: 7.5k; CompType: Resistor; PartNumber: CRCW12067K50JNEA; ComponentLink1Description: Datasheet link; Supplier Part Number 1: 541-7.5KECT-ND; Technology: Thick Film; ComponentLink1URL: http://www.vishay.com/docs/20035/dcrcwe3.pdf
R46 = CMP-0015368-2: RES, 0, 5%, 2 W, 2512 WIDE; PartNumber: RCL12250000Z0EG; Manufacturer: Vishay Draloric; Value: 0; Value_Code: 0000; Power_W: 2W; TempCo: ppm/C; EIA_Code: E24; U/M: EA; AEC Category: Q200; Green_Lifecycle: Active; Green_REACh: Passed; CompType: Resistor; SymbolVersion: 2009-05-29; PackageReference: 2512 WIDE; RoHS: Y; Res_ohm: 0; Tolerance_%: 5%; Value1: 5%; Value2: 2W; MountType: SMT; Technology: Thick Film; Published: 2008-06-26; Publisher: Texas Instruments; LatestRevisionDate: 2017-03-09; ComponentLink1Description: Datasheet link; ComponentLink1URL: http://www.vishay.com/docs/20046/rcle3.pdf; Supplier 1: Digi-Key; Supplier Part Number 1: RCL0.0ECT-ND; Supplier 2: Mouser; Supplier Part Number 2: 71-RCL12250000Z0EG; AEC Qualified: ?; Green_EU RoHS: Passed with Exemption; Green_EU RoHS-2: Incomplete
R55 = CMP-0025825-4: RES, 51, 5%, 0.1 W, AEC-Q200 Grade 0, 0603; Manufacturer: Vishay-Dale; Value: 51; Value_Code: 51R0; Power_W: 100mW; Value2: 0.1W; VDC_V: 75V; TempCo: 200 ppm/C; EIA_Code: E24; SizeArea_mm2: 1.28; SizeX_mm: 1.6; SizeY_mm: 0.8; SizeZ_mm: 1; AEC Category: Q200; AEC Qualified: Y; AEC Grade: 0; CompType: Resistor; PartNumber: CRCW060351R0JNEA; PackageReference: 0603; RoHS: E; Res_ohm: 51; Tolerance_%: 5%; Value1: 5%; MountType: SMT; Technology: Thick Film; ComponentLink1Description: Datasheet link; ComponentLink1URL: http://www.vishay.com/docs/20035/dcrcwe3.pdf; Supplier 1: Digi-Key; Supplier Part Number 1: 541-51GCT-ND; Supplier 2: Newark; Supplier Part Number 2: 59M6822; Supplier 3: Mouser; Supplier Part Number 3: 71-CRCW0603J-51-E3
R56 = CMP-0025697-4: RES, 0, 5%, 0.1 W, AEC-Q200 Grade 0, 0603; Manufacturer: Vishay-Dale; Value: 0; Value_Code: 0000; Power_W: 100mW; Value2: 0.1W; VDC_V: 75V; TempCo: 200 ppm/C; EIA_Code: E24; SizeArea_mm2: 1.28; SizeX_mm: 1.6; SizeY_mm: 0.8; SizeZ_mm: 1; AEC Category: Q200; AEC Qualified: Y; CompType: Resistor; PartNumber: CRCW06030000Z0EA; PackageReference: 0603; RoHS: E; Res_ohm: 0; Tolerance_%: 5%; Value1: 5%; MountType: SMT; Technology: Thick Film; ComponentLink1Description: Datasheet link; ComponentLink1URL: http://www.vishay.com/docs/20035/dcrcwe3.pdf; Supplier 1: Digi-Key; Supplier Part Number 1: 541-0.0GCT-ND; Supplier 2: Newark; Supplier Part Number 2: 52K8014; Supplier 3: Mouser; Supplier Part Number 3: 71-CRCW0603-0-E3; AEC Grade: 0
R57 = CMP-0025701-4: RES, 10 k, 5%, 0.1 W, AEC-Q200 Grade 0, 0603; PartNumber: CRCW060310K0JNEA; Manufacturer: Vishay-Dale; Value: 10k; Value_Code: 10k0; Power_W: 100mW; Value2: 0.1W; VDC_V: 75V; TempCo: 200 ppm/C; EIA_Code: E24; U/M: EA; SizeArea_mm2: 1.28; SizeX_mm: 1.6; SizeY_mm: 0.8; SizeZ_mm: 1; AEC Category: Q200; AEC Qualified: Y; AEC Grade: 0; CompType: Resistor; SymbolVersion: 2009-05-29; PackageReference: 0603; RoHS: E; Res_ohm: 10k; Tolerance_%: 5%; Value1: 5%; MountType: SMT; Technology: Thick Film; Published: 2008-06-26; Publisher: Texas Instruments; LatestRevisionDate: 2017-06-13; ComponentLink1Description: Datasheet link; ComponentLink1URL: http://www.vishay.com/docs/20035/dcrcwe3.pdf; Supplier 1: Digi-Key; Supplier Part Number 1: 541-10KGCT-ND; Supplier 2: Newark; Supplier Part Number 2: 52K8066; Supplier 3: Mouser; Supplier Part Number 3: 71-CRCW0603J-10K-E3
R59 R82 = CMP-0025830-4: RES, 5.1 k, 5%, 0.1 W, AEC-Q200 Grade 0, 0603; PartNumber: CRCW06035K10JNEA; Manufacturer: Vishay-Dale; Value: 5.1k; Value_Code: 5k10; Power_W: 100mW; Value2: 0.1W; VDC_V: 75V; TempCo: 200 ppm/C; EIA_Code: E24; U/M: EA; SizeArea_mm2: 1.28; SizeX_mm: 1.6; SizeY_mm: 0.8; SizeZ_mm: 1; AEC Category: Q200; AEC Qualified: Y; AEC Grade: 0; CompType: Resistor; SymbolVersion: 2009-05-29; PackageReference: 0603; RoHS: E; Res_ohm: 5.1k; Tolerance_%: 5%; Value1: 5%; MountType: SMT; Technology: Thick Film; Published: 2008-06-26; Publisher: Texas Instruments; LatestRevisionDate: 2017-06-13; ComponentLink1Description: Datasheet link; ComponentLink1URL: http://www.vishay.com/docs/20035/dcrcwe3.pdf; Supplier 1: Digi-Key; Supplier Part Number 1: 541-5.1KGCT-ND; Supplier 2: Newark; Supplier Part Number 2: 89M6773; Supplier 3: Farnell; Supplier Part Number 3: 1570751
R60 = CMP-0025935-5: RES, 62 k, 5%, 0.1 W, 0603; Manufacturer: Yageo; Power_W: 100mW; TempCo: 100 ppm/C; Value_Code: 62k0; Value: 62k; EIA_Code: E24; SizeX_mm: 1.6; SizeY_mm: 0.8; SizeZ_mm: 1; Value2: 0.1W; SizeArea_mm2: 1.28; AEC Qualified: N; VDC_V: 75V; AEC Category: Q200; SizeAreaWB_mm2: 4.68; Supplier Part Number 2: 603-RC0603JR-0762KL; Supplier 2: Mouser; Supplier Part Number 3: 1799444; Supplier 3: Farnell; RoHS: Y; Value1: 5%; MountType: SMT; Supplier 1: Digi-Key; PackageReference: 0603; Tolerance_%: 5%; Res_ohm: 62k; CompType: Resistor; PartNumber: RC0603JR-0762KL; ComponentLink1Description: Datasheet link; Supplier Part Number 1: 311-62KGRCT-ND; Technology: Thick Film; ComponentLink1URL: http://www.yageo.com/pdf/Pu-RC0603_51_PbFree_L_2.pdf; AEC Grade: N/A
R61-R63 = CMP-0025830-4: RES, 5.1 k, 5%, 0.1 W, AEC-Q200 Grade 0, 0603; Manufacturer: Vishay-Dale; Value: 5.1k; Value_Code: 5k10; Power_W: 100mW; Value2: 0.1W; VDC_V: 75V; TempCo: 200 ppm/C; SizeArea_mm2: 1.28; SizeX_mm: 1.6; SizeY_mm: 0.8; SizeZ_mm: 1; EIA_Code: E24; AEC Category: Q200; AEC Qualified: Y; AEC Grade: 0; CompType: Resistor; PartNumber: CRCW06035K10JNEA; PackageReference: 0603; RoHS: E; Res_ohm: 5.1k; Tolerance_%: 5%; Value1: 5%; MountType: SMT; Technology: Thick Film; ComponentLink1Description: Datasheet link; ComponentLink1URL: http://www.vishay.com/docs/20035/dcrcwe3.pdf; Supplier 1: Digi-Key; Supplier Part Number 1: 541-5.1KGCT-ND; Supplier 2: Newark; Supplier Part Number 2: 89M6773; Supplier 3: Farnell; Supplier Part Number 3: 1570751
R64 R68 R70 R71 R73 R74 R76 R77 = CMP-0018703-3: RES, 5.1 k, 5%, 0.25 W, AEC-Q200 Grade 0, 1206; Manufacturer: Vishay-Dale; Value: 5.1k; Value_Code: 5k10; Power_W: 250mW; Value2: 0.25W; VDC_V: 200V; TempCo: 200 ppm/C; SizeArea_mm2: 5.12; SizeX_mm: 3.2; SizeY_mm: 1.6; SizeZ_mm: 1.35; EIA_Code: E24; AEC Category: Q200; AEC Qualified: Y; AEC Grade: 0; CompType: Resistor; PartNumber: CRCW12065K10JNEA; PackageReference: 1206; RoHS: E; Res_ohm: 5.1k; Tolerance_%: 5%; Value1: 5%; MountType: SMT; Technology: Thick Film; ComponentLink1Description: Datasheet link; ComponentLink1URL: http://www.vishay.com/docs/20035/dcrcwe3.pdf; Supplier 1: Digi-Key; Supplier Part Number 1: 541-5.1KECT-ND; Supplier 2: Newark; Supplier Part Number 2: 59M8589; Supplier 3: Mouser; Supplier Part Number 3: 71-CRCW1206J-5.1K-E3
R65 = CMP-0025855-4: RES, 7.5 k, 5%, 0.1 W, AEC-Q200 Grade 0, 0603; Manufacturer: Vishay-Dale; Power_W: 100mW; TempCo: 200 ppm/C; Value_Code: 7k50; Value: 7.5k; EIA_Code: E24; SizeX_mm: 1.6; SizeY_mm: 0.8; SizeZ_mm: 1; Value2: 0.1W; SizeArea_mm2: 1.28; AEC Qualified: Y; VDC_V: 75V; AEC Category: Q200; AEC Grade: 0; Supplier Part Number 2: 59M6832; Supplier 2: Newark; Supplier Part Number 3: 71-CRCW0603J-7.5K-E3; Supplier 3: Mouser; RoHS: E; Value1: 5%; MountType: SMT; Supplier 1: Digi-Key; PackageReference: 0603; Tolerance_%: 5%; Res_ohm: 7.5k; CompType: Resistor; PartNumber: CRCW06037K50JNEA; ComponentLink1Description: Datasheet link; Supplier Part Number 1: 541-7.5KGCT-ND; Technology: Thick Film; ComponentLink1URL: http://www.vishay.com/docs/20035/dcrcwe3.pdf
R66 = CMP-0025753-4: RES, 20 k, 5%, 0.1 W, AEC-Q200 Grade 0, 0603; PartNumber: CRCW060320K0JNEA; Manufacturer: Vishay-Dale; Value: 20k; Value_Code: 20k0; Power_W: 100mW; Value2: 0.1W; VDC_V: 75V; TempCo: 200 ppm/C; EIA_Code: E24; U/M: EA; SizeArea_mm2: 1.28; SizeX_mm: 1.6; SizeY_mm: 0.8; SizeZ_mm: 1; AEC Category: Q200; AEC Qualified: Y; AEC Grade: 0; CompType: Resistor; SymbolVersion: 2009-05-29; PackageReference: 0603; RoHS: E; Res_ohm: 20k; Tolerance_%: 5%; Value1: 5%; MountType: SMT; Technology: Thick Film; Published: 2008-06-26; Publisher: Texas Instruments; LatestRevisionDate: 2017-06-13; ComponentLink1Description: Datasheet link; ComponentLink1URL: http://www.vishay.com/docs/20035/dcrcwe3.pdf; Supplier 1: Digi-Key; Supplier Part Number 1: 541-20KGCT-ND; Supplier 2: Newark; Supplier Part Number 2: 59M6783; Supplier 3: Mouser; Supplier Part Number 3: 71-CRCW0603J-20K-E3
R80 = CMP-0025766-4: RES, 27 k, 5%, 0.1 W, AEC-Q200 Grade 0, 0603; Manufacturer: Vishay-Dale; Power_W: 100mW; TempCo: 200 ppm/C; Value_Code: 27k0; Value: 27k; EIA_Code: E24; SizeX_mm: 1.6; SizeY_mm: 0.8; SizeZ_mm: 1; Value2: 0.1W; SizeArea_mm2: 1.28; AEC Qualified: Y; VDC_V: 75V; AEC Category: Q200; AEC Grade: 0; Supplier Part Number 2: 59M6792; Supplier 2: Newark; Supplier Part Number 3: 71-CRCW0603J-27K-E3; Supplier 3: Mouser; RoHS: E; Value1: 5%; MountType: SMT; Supplier 1: Digi-Key; PackageReference: 0603; Tolerance_%: 5%; Res_ohm: 27k; CompType: Resistor; PartNumber: CRCW060327K0JNEA; ComponentLink1Description: Datasheet link; Supplier Part Number 1: 541-27KGCT-ND; Technology: Thick Film; ComponentLink1URL: http://www.vishay.com/docs/20035/dcrcwe3.pdf
TP20-TP36 = CMP-0078143-2: TEST POINT.  No entry in BOM.; CompType: Testpoint; PackageReference: N/A; Library Reference: TESTPOINT; Manufacturer: N/A; PartNumber: N/A
U2-U5 = CMP-0078902-2: Family 2-5S Overvoltage Protector with Internal Delay Timer, DPJ0008A (WSON-8); Alternate PartNumber: BQ771807DPJT; Alternate Manufacturer: Texas Instruments; SizeAreaWB_mm2: 20; SizeZ_mm: 0.8; SizeX_mm: 4; SizeY_mm: 3; SizeArea_mm2: 12; CompType: IC; AEC Qualified: N; AEC Category: Q200; ComponentLink1URL: http://www.ti.com/lit/ds/symlink/bq7718.pdf; PackageDescription: WSON-8; RoHS: Y; MountType: SMT; ComponentLink2URL: http://www.ti.com/product/bq7718; ComponentLink2Description: Product Folder; Manufacturer: Texas Instruments; PackageReference: DPJ0008A; PartNumber: BQ771807DPJR; ComponentLink1Description: Datasheet Link